# Altium schematic sheet 4_battery_monitoring_and_switches.schdoc: Batteries Monitor and Power Switches
size A3; DrawnBy: Sara V. Martínez; Engineer: Flight; DocumentNumber: 5; Revision: V0.1; SheetNumber: 5; SheetTotal: 11; Designed by: Andre M. P. Mattos; ProjectRevision: v0.2
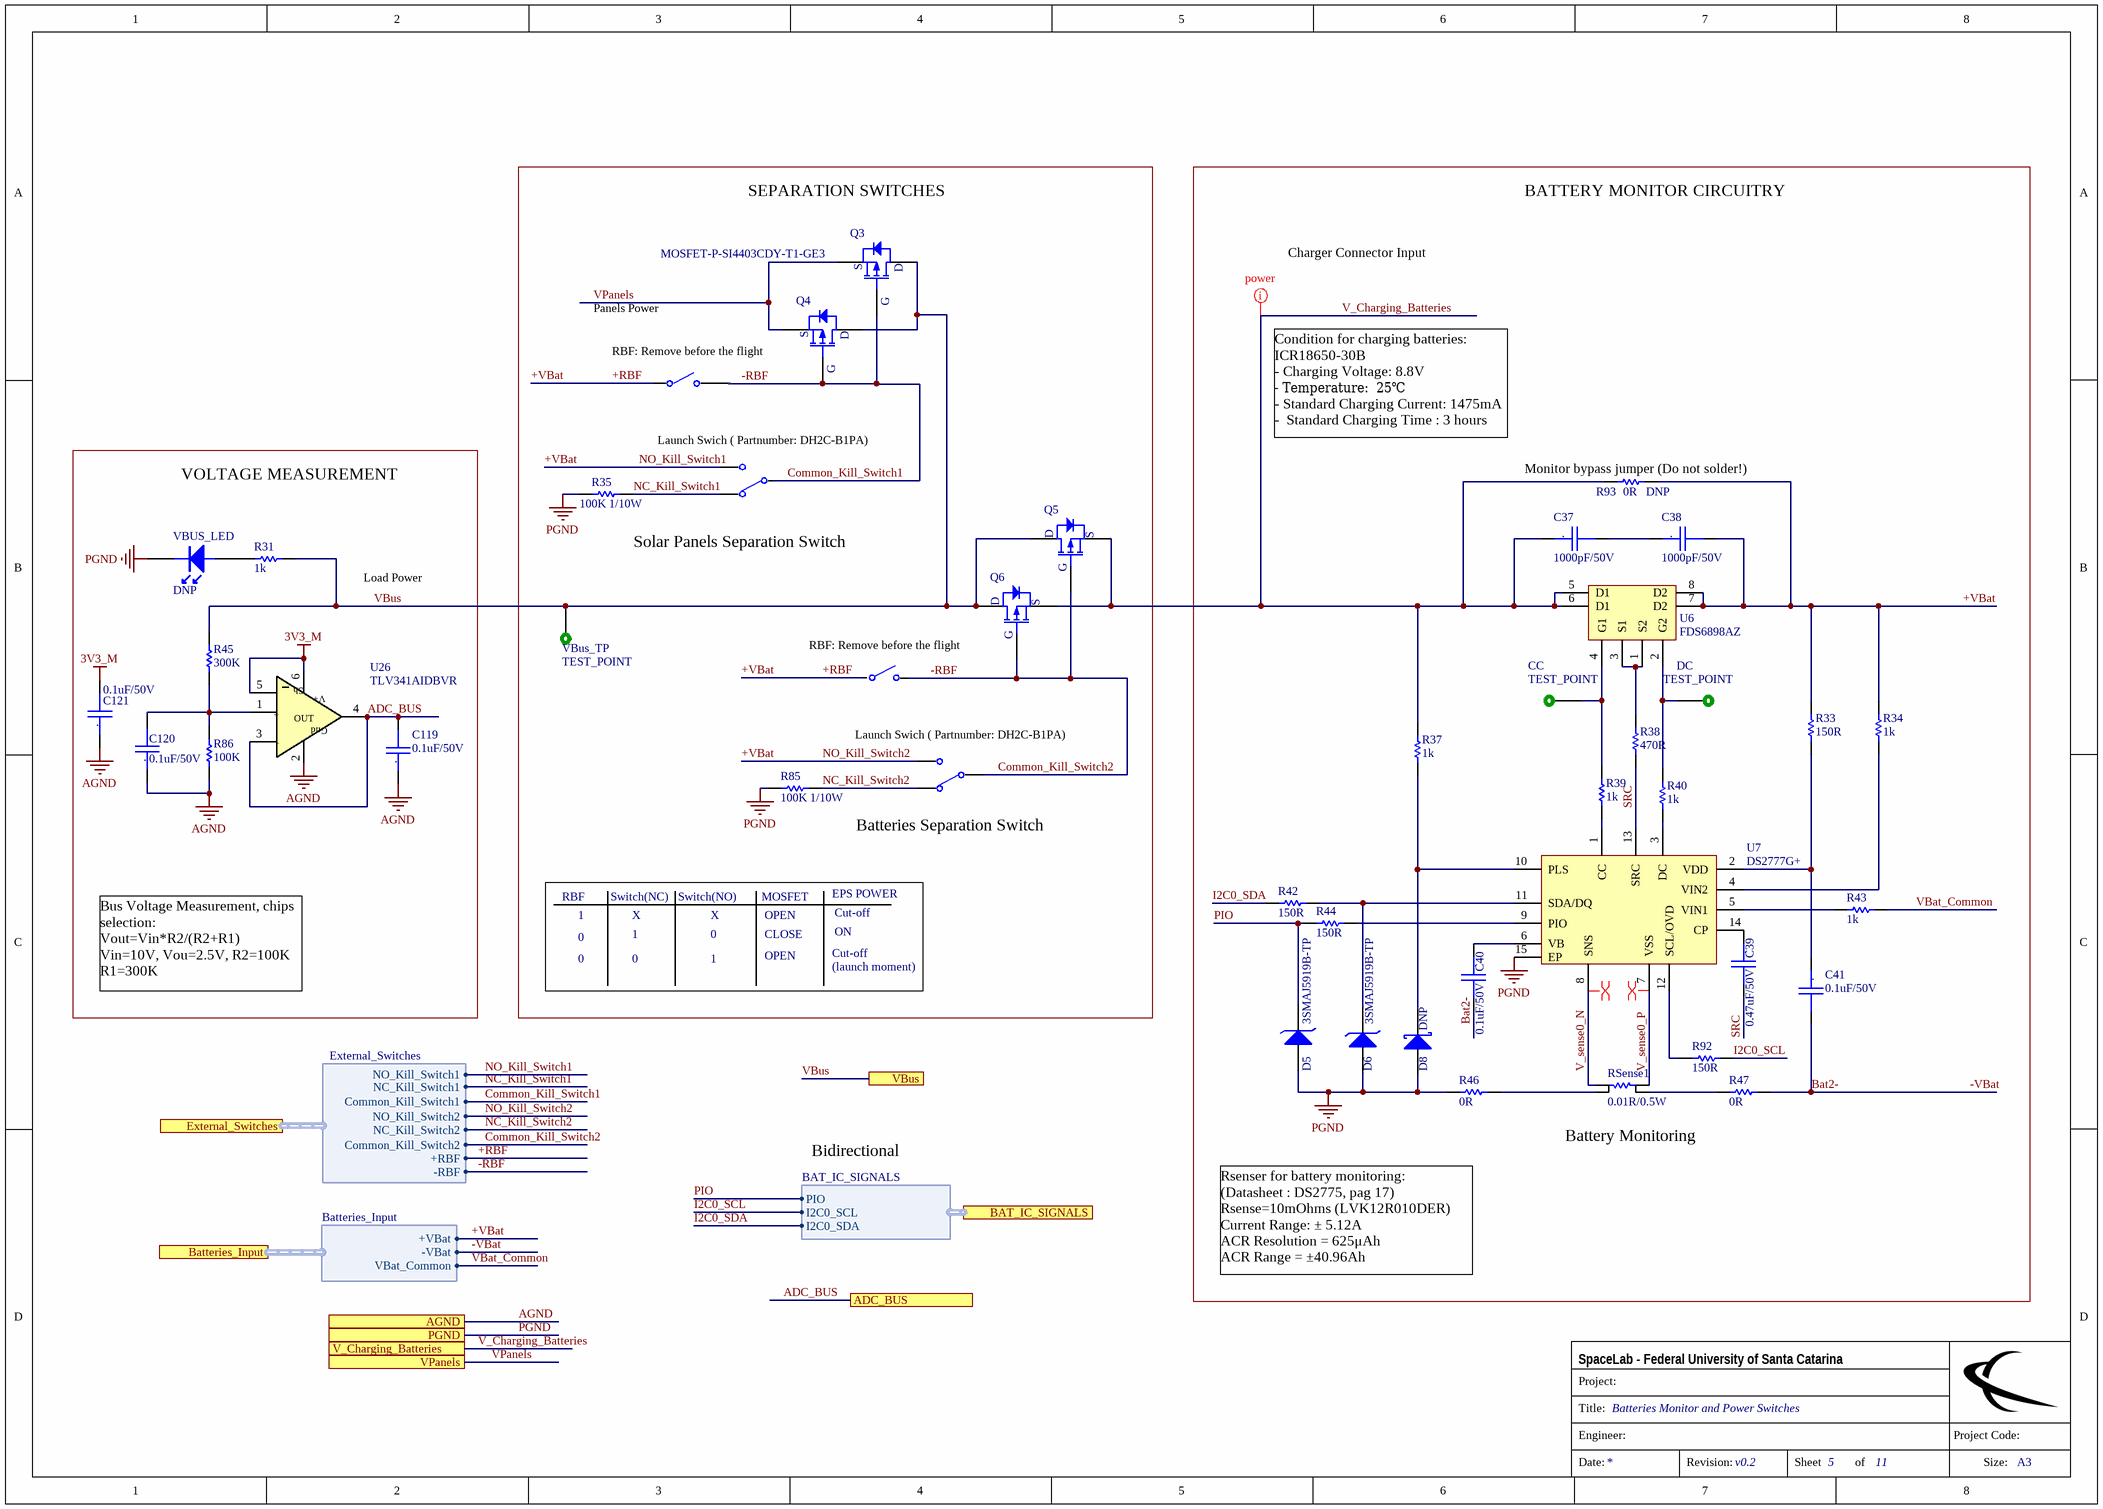
[diagram p0: 4_battery_monitoring_and_switches.schdoc]

## Parts
C37  1000pF/50V  [CC0603]
C38  1000pF/50V  [CC0603]
C39  0.47uF/50V  [CC0603]
C40  0.1uF/50V  [CC0603]
C41  0.1uF/50V  [CC0603]
C119  0.1uF/50V  [CC0603]
C120  0.1uF/50V  [CC0603]
C121  0.1uF/50V  [CC0603]
CC  TEST_POINT  [TEST_POINT]  (no BOM)
D5  3SMAJ5919B-TP  [DO-214AC]
D6  3SMAJ5919B-TP  [DO-214AC]
D8  DNP  [SOD323F]
DC  TEST_POINT  [TEST_POINT]  (no BOM)
Q3  MOSFET-P-SI4403CDY-T1-GE3  [SOIC8_Mosfet]  (value not drawn)
Q4  MOSFET-P-SI4403CDY-T1-GE3  [SOIC8_Mosfet]
Q5  MOSFET-P-SI4403CDY-T1-GE3  [SOIC8_Mosfet]  (value not drawn)
Q6  MOSFET-P-SI4403CDY-T1-GE3  [SOIC8_Mosfet]  (value not drawn)
R31  1k  [0603]
R33  150R  [0603]
R34  1k  [0603]
R35  100K 1/10W  [0805]
R37  1k  [0603]
R38  470R  [0603]
R39  1k  [0603]
R40  1k  [0603]
R42  150R  [0603]
R43  1k  [0603]
R44  150R  [0603]
R45  300K  [0603]
R46  0R  [1206]
R47  0R  [1206]
R85  100K 1/10W  [0805]
R86  100K  [0603]
R92  150R  [R0603]
R93  0R  [1206]
RSense1  0.01R/0.5W  [1206 - ohmite]
U6  FDS6898AZ  [SOIC8]
U7  DS2777G+  [TDFN-14-EP_3x5]
U26  TLV341AIDBVR  [SOT-23 6L]
VBUS_LED  DNP  [0603-LED]
VBus_TP  TEST_POINT  [TEST_POINT]  (no BOM)

## Blocks framed on the sheet
VOLTAGE MEASUREMENT: C119-C121 R31 R45 R86 U26 VBUS_LED

## Ports
ADC_BUS, AGND, BAT_IC_SIGNALS (harness BAT_IC_SIGNALS), Batteries_Input (harness Batteries_Input), External_Switches (harness External_Switches), PGND, V_Charging_Batteries, VBus, VPanels

## Harnesses
External_Switches: NO_Kill_Switch1, NC_Kill_Switch1, NO_Kill_Switch2, NC_Kill_Switch2, +RBF, -RBF, Common_Kill_Switch1, Common_Kill_Switch2
Batteries_Input: +VBat, -VBat, VBat_Common
BAT_IC_SIGNALS: I2C0_SCL, I2C0_SDA, PIO

## Nets
3V3_M: C121.2 U26.5(EN) U26.6(V+)
AGND: C119.1 C120.1 C121.1 R86.1 U26.2(Gnd) ; port AGND
PGND: D5.2(A) D6.2(A) D8.2(A) R35.2 R46.2 R85.2 U7.15(EP) VBUS_LED.2(K) ; port PGND
+RBF: C38.2 R33.1 R34.2 R93.1 U6.7(D2) U6.8(D2) ; port External_Switches.NO_Kill_Switch1, port External_Switches.NO_Kill_Switch2, port External_Switches.+RBF, port Batteries_Input.+VBat  [also labelled +VBat, NO_Kill_Switch1, NO_Kill_Switch2]
-RBF: Q3.2(G) Q4.2(G) Q5.2(G) Q6.2(G) ; port External_Switches.-RBF, port External_Switches.Common_Kill_Switch1, port External_Switches.Common_Kill_Switch2  [also labelled Common_Kill_Switch1, Common_Kill_Switch2]
-VBat: C40.2 C41.2 R47.1 ; port Batteries_Input.-VBat  [also labelled Bat2-]
ADC_BUS: C119.2 U26.3(-IN) U26.4(OUT) ; port ADC_BUS
I2C0_SCL: R92.1 ; port BAT_IC_SIGNALS.I2C0_SCL
I2C0_SDA: R42.2 ; port BAT_IC_SIGNALS.I2C0_SDA
NC_Kill_Switch1: R35.1 ; port External_Switches.NC_Kill_Switch1
NC_Kill_Switch2: R85.1 ; port External_Switches.NC_Kill_Switch2
PIO: D5.1(K) R44.2 ; port BAT_IC_SIGNALS.PIO
SRC: C39.2 R38.1 U7.13(SRC)
V_Charging_Batteries: C37.1 Q5.1(S) Q6.1(S) R37.2 R93.2 U6.5(D1) U6.6(D1) ; port V_Charging_Batteries
V_sense0_N: RSense1.2 U7.8(SNS)
V_sense0_P: RSense1.1 U7.7(VSS)
VBat_Common: R43.1 ; port Batteries_Input.VBat_Common
VBus: Q3.3(D) Q4.3(D) Q5.3(D) Q6.3(D) R31.1 R45.2 VBus_TP.1 ; port VBus
VPanels: Q3.1(S) Q4.1(S) ; port VPanels
NetC37_2: C37.2 C38.1
NetC39_1: C39.1 U7.14(CP)
NetC40_1: C40.1 U7.6(VB)
NetC41_1: C41.1 R33.2 U7.2(VDD)
NetC120_2: C120.2 R45.1 R86.2 U26.1(+IN)
NetCC_1: CC.1 R39.2 U6.4(G1)
NetD6_1: D6.1(K) R42.1 U7.11(SDA/DQ)
NetD8_1: D8.1(K) R37.1 U7.10(PLS)
NetDC_1: DC.1 R40.2 U6.2(G2)
NetR31_2: R31.2 VBUS_LED.1(A)
NetR34_1: R34.1 U7.4(VIN2)
NetR38_2: R38.2 U6.1(S2) U6.3(S1)
NetR39_1: R39.1 U7.1(CC)
NetR40_1: R40.1 U7.3(DC)
NetR43_2: R43.2 U7.5(VIN1)
NetR44_1: R44.1 U7.9(PIO)
NetR46_1: R46.1 RSense1.4
NetR47_2: R47.2 RSense1.3
NetR92_2: R92.2 U7.12(SCL/OVD)

## Layout directives
differential pair: V_sense0_N, V_sense0_P
net class power: V_Charging_Batteries

## Notes on the sheet
- SEPARATION SWITCHES
- BATTERY MONITOR CIRCUITRY
- Panels Power
- Charger Connector Input
- (near Q4) RBF: Remove before the flight
- Launch Swich ( Partnumber: DH2C-B1PA)
- Condition for charging batteries:  ICR18650-30B
  - Charging Voltage: 8.8V
  - Temperature:  25℃
  - Standard Charging Current: 1475mA
  -  Standard Charging Time : 3 hours
- (near R93) Monitor bypass jumper (Do not solder!)
- (near R93) DNP
- Load Power
- (near R35) Solar Panels Separation Switch
- (near Q6) RBF: Remove before the flight
- Batteries Separation Switch
- RBF
- 1
- Switch(NC)
- X
- Switch(NO)
- MOSFET
- OPEN
- EPS POWER
- Cut-off
- Bus Voltage Measurement, chips selection:
  Vout=Vin*R2/(R2+R1)
  Vin=10V, Vou=2.5V, R2=100K
  R1=300K
- 0
- CLOSE
- (launch moment)
- ON
- Bidirectional
- Battery Monitoring
- Rsenser for battery monitoring:
  (Datasheet : DS2775, pag 17)
  Rsense=10mOhms (LVK12R010DER)
  Current Range: ± 5.12A
  ACR Resolution = 625μAh
  ACR Range = ±40.96Ah
- Project:
- SpaceLab - Federal University of Santa Catarina
- Title:
- Engineer:
- Project Code:
- Date:
- Revision:
- Sheet
- of
- Size:
- A3
- (in symbol Cap_Cer_X7R_0.1uF_50V_0603) .
- (in symbol Cap_Cer_X7R_0.47uF_50V_0603) .
- (in symbol Cap_Cer_X7R_1000pF_50V_0603) .
- (in symbol TLV341AIDBVR) Sh; +; -

## Library data of the parts
C37 C38 = Cap_Cer_X7R_1000pF_50V_0603: CAP CER 1000pF 50V 10% X7R 0603; Partnumber: CC0603KRX7R9BB102; Manufacturer: Yageo; Capacitance: 1nF; Insulation Resistance: 100GR; Material: Ceramic; NCM: 8532.24.10; Case/Package: 0603; Case Code (Imperial): 0603; Case Code (Metric): 1608; ComponentLink1Description: http://www.yageo.com/documents/recent/UPY-GPHC_X7R_6.3V-to-50V_18.pdf?src-supplier=Digi-Key; ComponentLink1URL: http://www.yageo.com/documents/recent/UPY-GPHC_X7R_6.3V-to-50V_18.pdf?src-supplier=Digi-Key; ComponentLink2Description: http://www.yageo.com/documents/recent/UPY-GPHC_X7R_6.3V-to-50V_8.pdf?src-supplier=Avnet+Europe; ComponentLink2URL: http://www.yageo.com/documents/recent/UPY-GPHC_X7R_6.3V-to-50V_8.pdf?src-supplier=Avnet+Europe; ComponentLink3Description: https://www.verical.com/server-webapp/html/getDatasheet?partID=251790&src-supplier=Verical; ComponentLink3URL: https://www.verical.com/server-webapp/html/getDatasheet?partID=251790&src-supplier=Verical; ComponentLink4Description: http://www.farnell.com/datasheets/2167236.pdf?src-supplier=Element14; ComponentLink4URL: http://www.farnell.com/datasheets/2167236.pdf?src-supplier=Element14; ComponentLink5Description: https://produktinfo.conrad.com/datenblaetter/425000-449999/445532-da-01-en-KERKO_CHIP_0603_NP0_1000PF.pdf?src-supplier=Conrad; ComponentLink5URL: https://produktinfo.conrad.com/datenblaetter/425000-449999/445532-da-01-en-KERKO_CHIP_0603_NP0_1000PF.pdf?src-supplier=Conrad; Composition: Ceramic; Depth: 0.8mm; Dielectric: X7R; Halogen Free: Halogen Free; Height: 0.8mm; Lead Free: Lead Free; Length: 1.6mm; Manufacturer Part Number: CC0603KRX7R9BB102; Max Operating Temperature: 125°C; Min Operating Temperature: -55°C; Mount: Surface Mount; Number of Pins: 2; Package Quantity: 1; Packaging: Tape and Reel; Pricing 1: 1=0.1, 10=0.039, 100=0.018, 1000=0.014, 4000=0.01, 8000=0.008 (USD); Pricing 2: 1=0.1, 10=0.042, 50=0.0232, 100=0.0189, 500=0.01352, 1000=0.01062 (USD); Radiation Hardening: No; REACH SVHC: No SVHC; Stock 1: 411776; Stock 2: 2512329; Supplier 1: Mouser; Supplier 2: Digi-Key; Supplier Part Number 1: 603-CC603KRX7R9BB102; Supplier Part Number 2: 311-1080-1-ND; Termination: SMD/SMT; Thickness: 0.035inch; Tolerance: 10%; Voltage: 50V; Voltage Rating (DC): 50V; Voltage Rating: 50V; Width: 0.031inch
C39 = Cap_Cer_X7R_0.47uF_50V_0603: CAP CER 0.47UF 50V 10% X7R 0603; Partnumber: C1608X7R1H474K080AE; Manufacturer: TDK; Capacitance: 470nF; NCM: 8532.24.10; Case/Package: 0603; Case Code (Imperial): 0603; Case Code (Metric): 1608; ComponentLink1Description: http://www.mouser.com/ds/2/400/tdk_mlcc_commercial_general_en-542463.pdf?src-supplier=Mouser; ComponentLink1URL: http://www.mouser.com/ds/2/400/tdk_mlcc_commercial_general_en-542463.pdf?src-supplier=Mouser; ComponentLink2Description: https://product.tdk.com/info/en/catalog/datasheets/mlcc_commercial_soft_en.pdf?src-supplier=Digi-Key; ComponentLink2URL: https://product.tdk.com/info/en/catalog/datasheets/mlcc_commercial_soft_en.pdf?src-supplier=Digi-Key; ComponentLink3Description: https://product.tdk.com/info/en/catalog/spec/mlccspec_commercial_soft_en.pdf?src-supplier=Digi-Key; ComponentLink3URL: https://product.tdk.com/info/en/catalog/spec/mlccspec_commercial_soft_en.pdf?src-supplier=Digi-Key; Dielectric: X7R; Features: Soft Termination; Height: 0.8mm; Lead Free: Lead Free; Length: 0.063inch; Manufacturer Part Number: C1608X7R1H474K080AE; Max Operating Temperature: 125°C; Min Operating Temperature: -55°C; Mount: Surface Mount; Package Quantity: 4000; Packaging: Tape and Reel; Pricing 1: 1=0.35, 10=0.24, 100=0.144, 500=0.108, 1000=0.091, 4000=0.077 (USD); Pricing 2: 1=0.33, 10=0.23, 50=0.161, 100=0.1379, 500=0.10346, 1000=0.08736 (USD); Stock 1: 82530; Stock 2: 9176; Supplier 1: Mouser; Supplier 2: Digi-Key; Supplier Part Number 1: 810-C1608X7R1H474K0E; Supplier Part Number 2: 445-172485-1-ND; Termination: SMD/SMT; Thickness: 0.037inch; Tolerance: 10%; Voltage Rating (DC): 50V; Voltage Rating: 50V; Weight: 7.1E-05oz; Width: 0.8mm
C40 C41 C119-C121 = Cap_Cer_X7R_0.1uF_50V_0603: CAP CER 0.1UF 50V 10% X7R 0603; Partnumber: CC0603KPX7R9BB104; Manufacturer: Yageo; Capacitance: 100nF; Case/Package: 0603; Case Code (Imperial): 0603; Case Code (Metric): 1608; ComponentLink1Description: https://www.verical.com/server-webapp/html/getDatasheet?partID=653026&src-supplier=Verical; ComponentLink1URL: https://www.verical.com/server-webapp/html/getDatasheet?partID=653026&src-supplier=Verical; Composition: Ceramic; Depth: 0.8mm; Dielectric: X7R; Halogen Free: Halogen Free; Height: 0.8mm; Lead Free: Lead Free; Length: 1.6mm; Manufacturer Part Number: CC0603KPX7R9BB104; Max Operating Temperature: 125°C; Min Operating Temperature: -55°C; Mount: Surface Mount; Number of Pins: 2; Packaging: Tape and Reel; Pricing 1: 1=0.1, 10=0.065, 100=0.02, 1000=0.016, 2500=0.013, 10000=0.01 (USD); Pricing 2: 1=0.1, 10=0.066, 50=0.036, 100=0.0293, 500=0.02094, 1000=0.01646, 2500=0.01496, 5000=0.01376 (USD); Radiation Hardening: No; Stock 1: 5712768; Stock 2: 0; Supplier 1: Mouser; Supplier 2: Digi-Key; Supplier Part Number 1: 603-CC603KPX7R9BB104; Supplier Part Number 2: 311-3567-1-ND; Termination: SMD/SMT; Thickness: 0.035inch; Tolerance: 10%; Voltage Rating (DC): 50V; Voltage Rating: 50V; Weight: 7.1E-05oz; Width: 0.031inch
CC DC VBus_TP = TEST_POINT: Test point
D5 D6 = DIODE_ZENER_5.6V_3SMAJ5919B: DIODE ZENER 5.6V 3W DO214AC; Manufacturer: MCC; Element Configuration: Single; Impedance: 2R; Max Reverse Leakage Current: 5uA; Tolerance: 5%; Zener Current: 534mA; Partnumber: 3SMAJ5919B-TP; NCM: 8541.10.29; Case/Package: SMA; ComponentLink1Description: http://www.mccsemi.com/up_pdf/3SMAJ5913B~3SMAJ5943B(DO-214AC).pdf?src-supplier=Digi-Key; ComponentLink1URL: http://www.mccsemi.com/up_pdf/3SMAJ5913B~3SMAJ5943B(DO-214AC).pdf?src-supplier=Digi-Key; Manufacturer Part Number: 3SMAJ5919B-TP; Max Operating Temperature: 150°C; Max Power Dissipation: 3W; Min Operating Temperature: -55°C; Mount: Surface Mount; Number of Pins: 2; Package Quantity: 7500; Packaging: Tape and Reel; Power Dissipation: 3W; Pricing 1: 1=0.48, 10=0.354, 100=0.225, 500=0.199, 1000=0.143, 2500=0.134 (USD); Pricing 2: 1=0.46, 10=0.376, 25=0.344, 100=0.216, 250=0.2136, 500=0.2, 1000=0.136, 2500=0.1304 (USD); Stock 1: 26433; Stock 2: 61482; Supplier 1: Mouser; Supplier 2: Digi-Key; Supplier Part Number 1: 833-3SMAJ5919B-TP; Supplier Part Number 2: 3SMAJ5919B-TPMSCT-ND; Voltage Tolerance: 5%; Zener Voltage: 5.6V
D8 = DIODE_SCHOTTKY_23V_1A_NSVR0320MW2T1G: DIODE SCHOTTKY 23V 1A SOD323F; Manufacturer: ON Semiconductor; Element Configuration: Single; Forward Voltage: 500mV; Max Forward Surge Current (Ifsm): 5A; Max Repetitive Reverse Voltage (Vrrm): 20V; Max Reverse Leakage Current: 1mA; Peak Reverse Current: 50uA; NCM: 8541.10.29; Partnumber: NSVR0320MW2T1G; Average Rectified Current: 1A; Case/Package: SOD-323-2; ComponentLink1Description: http://www.onsemi.com/pub/Collateral/NSR0320MW2T1-D.PDF?src-supplier=Avnet; ComponentLink1URL: http://www.onsemi.com/pub/Collateral/NSR0320MW2T1-D.PDF?src-supplier=Avnet; ComponentLink2Description: http://www.onsemi.com/pub/Collateral/NSR0320MW2T1-D.PDF?src-supplier=Digi-Key; ComponentLink2URL: http://www.onsemi.com/pub/Collateral/NSR0320MW2T1-D.PDF?src-supplier=Digi-Key; Forward Current: 1A; Height: 0.9mm; Lead Free: Lead Free; Length: 1.8mm; Manufacturer Part Number: NSVR0320MW2T1G; Max Operating Temperature: 125°C; Max Reverse Voltage (DC): 20V; Max Surge Current: 5A; Min Operating Temperature: -55°C; Number of Pins: 2; Package Quantity: 3000; Packaging: Tape and Reel; Pricing 1: 1=0.38, 10=0.254, 100=0.118, 1000=0.092, 3000=0.081, 9000=0.071 (USD); Pricing 2: 1=0.38, 10=0.282, 25=0.2548, 100=0.1343, 250=0.13288, 500=0.119, 1000=0.0926 (USD); Radiation Hardening: No; REACH SVHC: No SVHC; Stock 1: 10408; Stock 2: 4746; Supplier 1: Mouser; Supplier 2: Digi-Key; Supplier Part Number 1: 863-NSVR0320MW2T1G; Supplier Part Number 2: NSVR0320MW2T1GOSCT-ND; Width: 1.35mm
Q3-Q6 = MOSFET-P- SI4403CDY-T1-GE3: MOSFET 1.8V P-Channel 20 V, 0.0155 Ω typ., 13.4 A; Manufacturer: Vishay Siliconix; Continuous Drain Current (ID): 13.4A; Drain to Source Breakdown Voltage: 20V; Drain to Source Resistance: 15.5mR; Fall Time: 41ns; Gate to Source Voltage (Vgs): 8V; Input Capacitance: 2.38nF; Max Power Dissipation: 5W; Number of Channels: 1; Power Dissipation: 2.5W; Rise Time: 18ns; Threshold Voltage: -400mV; Turn-Off Delay Time: 108ns; Turn-On Delay Time: 7ns; Published: 8-Jun-2000; LatestRevisionDate: 17-Jul-2002; LatestRevisionNote: Re-released for DXP Platform.; PackageVersion: 1995/1996; PackageReference: E3; Publisher: Altium Limited; PackageDescription: TO, Flat Index; 3 In-Line, Axial Leads; Body Dia. 4.6mm; Lead Dia. 0.5 mm (max); Partnumber: SI4403CDY-T1-GE3; Case/Package: SOIC; ComponentLink1Description: http://www.vishay.com/docs/71385/lokreel.pdf?src-supplier=Digi-Key; ComponentLink1URL: http://www.vishay.com/docs/71385/lokreel.pdf?src-supplier=Digi-Key; ComponentLink2Description: http://www.vishay.com/docs/67341/si4403cd.pdf?src-supplier=Avnet; ComponentLink2URL: http://www.vishay.com/docs/67341/si4403cd.pdf?src-supplier=Avnet; ComponentLink3Description: http://www.vishay.com/docs/67341/si4403cd.pdf?src-supplier=Avnet+Europe; ComponentLink3URL: http://www.vishay.com/docs/67341/si4403cd.pdf?src-supplier=Avnet+Europe; ComponentLink4Description: http://www.farnell.com/datasheets/1915828.pdf?src-supplier=Element14; ComponentLink4URL: http://www.farnell.com/datasheets/1915828.pdf?src-supplier=Element14; Contact Plating: Tin,Matte; Drain to Source Voltage (Vdss): 20V; Lead Free: Lead Free; Manufacturer Part Number: SI4403CDY-T1-GE3; Max Operating Temperature: 150°C; Min Operating Temperature: -55°C; Mount: Surface Mount; Number of Elements: 1; Number of Pins: 8; On-State Resistance: 15.5mR; Package Quantity: 2500; Packaging: Tape and Reel; Pricing 1: 1=0.68, 10=0.606, 100=0.472, 500=0.388, 1000=0.327, 2500=0.289 (USD); Pricing 2: 1=0.75, 10=0.66, 25=0.62, 100=0.45, 250=0.434, 500=0.376, 1000=0.32 (USD); Radiation Hardening: No; Rds On Max: 15.5mR; REACH SVHC: No SVHC; Stock 1: 6738; Stock 2: 1673; Supplier 1: Mouser; Supplier 2: Digi-Key; Supplier Part Number 1: 78-SI4403CDY-T1-GE3; Supplier Part Number 2: SI4403CDY-T1-GE3CT-ND; Weight: 0.01787oz
R31 R34 R37 R39 R40 R43 = R1.0k_1%_1/8W_0603: RES 1.0K OHM 1/8W 1% 0603; Partnumber: MCT06030C1001FP500; Manufacturer: Vishay; Max Power Dissipation: 125mW; Power Rating: 100mW; Resistance: 1kR; Temperature Coefficient: 50ppm/°C; Voltage Rating (DC): 75V; NCM: 8533.21.20; Case/Package: 0603; Case Code (Imperial): 0603; Case Code (Metric): 1608; ComponentLink1Description: http://www.vishay.com/docs/28705/mcx0x0xpro.pdf?src-supplier=Digi-Key; ComponentLink1URL: http://www.vishay.com/docs/28705/mcx0x0xpro.pdf?src-supplier=Digi-Key; ComponentLink2Description: http://www.vishay.com/docs/28705/mc_pro.pdf?src-supplier=Avnet+Europe; ComponentLink2URL: http://www.vishay.com/docs/28705/mc_pro.pdf?src-supplier=Avnet+Europe; ComponentLink3Description: http://www.vishay.com/docs/28705/mc_pro.pdf?src-supplier=Avnet; ComponentLink3URL: http://www.vishay.com/docs/28705/mc_pro.pdf?src-supplier=Avnet; ComponentLink4Description: http://www.vishay.com/docs/28705/mc_pro.pdf?src-supplier=Future+Electronics; ComponentLink4URL: http://www.vishay.com/docs/28705/mc_pro.pdf?src-supplier=Future+Electronics; Composition: Thin Film; Contact Plating: Tin; Depth: 0.85mm; Height: 0.022inch; Lead Free: Lead Free; Length: 1.55mm; Manufacturer Part Number: MCT06030C1001FP500; Max Operating Temperature: 125°C; Military Standard: Not; Min Operating Temperature: -55°C; Mount: Surface Mount; Number of Terminations: 2; Package Quantity: 1; Packaging: Tape and Reel; Pricing 1: 1=0.1, 1000=0.025, 2000=0.023, 5000=0.019, 10000=0.018, 20000=0.017 (USD); Pricing 2: 1=0.17, 10=0.145, 100=0.0568, 1000=0.02376, 2500=0.02178 (USD); Radiation Hardening: No; REACH SVHC: Unknown; Stock 1: 142157; Stock 2: 268907; Supplier 1: Mouser; Supplier 2: Digi-Key; Supplier Part Number 1: 594-MCT06030C1001FP5; Supplier Part Number 2: MCT0603-1.00K-CFCT-ND; Termination: SMD/SMT; Tolerance: 1%; Voltage Rating: 75V; Weight: 7.1E-05oz; Width: 0.033inch
R33 R42 R44 = R150R_1%_1/10W_0603: RES 150R OHM 1/10W 1% 0603; Partnumber: CRCW0603150RFKEA; Manufacturer: Vishay; Max Power Dissipation: 100mW; Temperature Coefficient: 100ppm/°C; Voltage Rating (DC): 75V; NCM: 8533.21.20; Case/Package: 0603; Case Code (Imperial): 0603; Case Code (Metric): 1608; ComponentLink1Description: http://www.vishay.com/docs/20035/dcrcwe3.pdf?src-supplier=Digi-Key; ComponentLink1URL: http://www.vishay.com/docs/20035/dcrcwe3.pdf?src-supplier=Digi-Key; ComponentLink2Description: http://www.mouser.com/ds/2/427/dcrcwe3-109170.pdf?src-supplier=Mouser; ComponentLink2URL: http://www.mouser.com/ds/2/427/dcrcwe3-109170.pdf?src-supplier=Mouser; ComponentLink3Description: http://uk.rs-online.com/webdocs/0d98/0900766b80d98afc.pdf?src-supplier=RSComponents; ComponentLink3URL: http://uk.rs-online.com/webdocs/0d98/0900766b80d98afc.pdf?src-supplier=RSComponents; ComponentLink4Description: http://www.vishay.com/docs/20035/dcrcwe3.pdf?src-supplier=Avnet+Europe; ComponentLink4URL: http://www.vishay.com/docs/20035/dcrcwe3.pdf?src-supplier=Avnet+Europe; ComponentLink5Description: https://www.distrelec.biz/Web/Downloads/a_/en/flD-CRCW-e3_data_en.pdf?mime=application%2Fpdf&src-supplier=Distrelec; ComponentLink5URL: https://www.distrelec.biz/Web/Downloads/a_/en/flD-CRCW-e3_data_en.pdf?mime=application%2Fpdf&src-supplier=Distrelec; ComponentLink6Description: http://www.farnell.com/datasheets/2310790.pdf?src-supplier=Element14; ComponentLink6URL: http://www.farnell.com/datasheets/2310790.pdf?src-supplier=Element14; ComponentLink7Description: https://www.alliedelec.com/m/d/0c934d6939ccefa68dbe0b96d821c8cf.pdf?src-supplier=Allied+Electronics; ComponentLink7URL: https://www.alliedelec.com/m/d/0c934d6939ccefa68dbe0b96d821c8cf.pdf?src-supplier=Allied+Electronics; ComponentLink8Description: http://www.vishay.com/docs/20035/dcrcwe3.pdf?src-supplier=Avnet; ComponentLink8URL: http://www.vishay.com/docs/20035/dcrcwe3.pdf?src-supplier=Avnet; Composition: Thick Film; Contact Plating: Tin; Depth: 0.85mm; Features: Automotive AEC-Q200; Height: 0.45mm; Lead Free: Lead Free; Length: 1.55mm; Manufacturer Part Number: CRCW0603150RFKEA; Max Operating Temperature: 155°C; Military Standard: Not; Min Operating Temperature: -55°C; Mount: Surface Mount; Number of Terminations: 2; Package Quantity: 10; Packaging: Tape and Reel; Power Rating: 100mW; Pricing 1: 1=0.1, 10=0.037, 100=0.034, 500=0.015, 1000=0.006, 2500=0.005 (USD); Pricing 2: 1=0.1, 10=0.034, 100=0.0139, 1000=0.00623, 2500=0.0054 (USD); Radiation Hardening: No; REACH SVHC: Unknown; Resistance: 150R; Stock 1: 109151; Stock 2: 5196; Supplier 1: Mouser; Supplier 2: Digi-Key; Supplier Part Number 1: 71-CRCW0603-150-E3; Supplier Part Number 2: 541-150HCT-ND; Termination: SMD/SMT; Tolerance: 1%; Voltage Rating: 75V; Weight: 7.1E-05oz; Width: 0.033inch
R35 R85 = R100k_0.1%_1/10W_0805: RES 100K OHM 1/10W 0.1% 0805; Partnumber: CPF-A-0805B100KE; Manufacturer: TE Connectivity; Max Power Dissipation: 100mW; Resistance: 100kR; Temperature Coefficient: 25ppm/°C; NCM: 8533.21.20; Case/Package: 0805; Case Code (Imperial): 0805; Case Code (Metric): 2012; ComponentLink1Description: https://www.te.com/commerce/DocumentDelivery/DDEController?Action=srchrtrv&amp;DocNm=1773200-1&amp;DocType=DS&amp;DocLang=English&src-supplier=Digi-Key; ComponentLink1URL: https://www.te.com/commerce/DocumentDelivery/DDEController?Action=srchrtrv&amp;DocNm=1773200-1&amp;DocType=DS&amp;DocLang=English&src-supplier=Digi-Key; Composition: Thin Film; Features: Moisture Resistant,Automotive AEC-Q200,Anti-Sulfur; Manufacturer Part Number: CPF-A-0805B100KE; Max Operating Temperature: 155°C; Min Operating Temperature: -55°C; Number of Terminations: 2; Packaging: Tape and Reel; Pricing 1: 1=0.57, 10=0.405, 100=0.2107, 1000=0.11343, 2500=0.11019 (USD); Stock 1: 2170; Supplier 1: Digi-Key; Supplier Part Number 1: 1712-CPF-A-0805B100KECT-ND; Tolerance: 0.1%
R38 = R470R_1%_1/8W_0603: RES 470R OHM 1/8W 1% 0603; Partnumber: MCT06030C4700FP500; Manufacturer: Vishay Beyschlag; Max Power Dissipation: 125mW; Temperature Coefficient: 50ppm/°C; Voltage Rating (DC): 75V; NCM: 8533.21.20; Case/Package: 0603; Case Code (Imperial): 0603; Case Code (Metric): 1608; ComponentLink1Description: http://www.vishay.com/docs/28705/mcx0x0xpro.pdf?src-supplier=Digi-Key; ComponentLink1URL: http://www.vishay.com/docs/28705/mcx0x0xpro.pdf?src-supplier=Digi-Key; ComponentLink2Description: http://www.vishay.com/docs/28705/mc_pro.pdf?src-supplier=Avnet; ComponentLink2URL: http://www.vishay.com/docs/28705/mc_pro.pdf?src-supplier=Avnet; ComponentLink3Description: http://www.vishay.com/docs/28705/mc_pro.pdf?src-supplier=Future+Electronics; ComponentLink3URL: http://www.vishay.com/docs/28705/mc_pro.pdf?src-supplier=Future+Electronics; ComponentLink4Description: http://www.vishay.com/docs/28705/mc_pro.pdf?src-supplier=Avnet+Europe; ComponentLink4URL: http://www.vishay.com/docs/28705/mc_pro.pdf?src-supplier=Avnet+Europe; Composition: Thin Film; Contact Plating: Tin; Depth: 0.85mm; Height: 0.022inch; Lead Free: Lead Free; Length: 0.061inch; Manufacturer Part Number: MCT06030C4700FP500; Max Operating Temperature: 125°C; Military Standard: Not; Min Operating Temperature: -55°C; Number of Terminations: 2; Package Quantity: 1; Packaging: Tape and Reel; Power Rating: 125mW; Pricing 1: 1=0.16, 50=0.076, 100=0.06, 500=0.034, 1000=0.023, 5000=0.019 (USD); Pricing 2: 1=0.17, 10=0.145, 100=0.0568, 1000=0.02376, 2500=0.02178 (USD); Radiation Hardening: No; REACH SVHC: No SVHC; Resistance: 470R; Stock 1: 14813; Stock 2: 21456; Supplier 1: Mouser; Supplier 2: Digi-Key; Supplier Part Number 1: 594-MCT06030C4700FP5; Supplier Part Number 2: MCT0603-470-CFCT-ND; Tolerance: 1%; Voltage Rating: 75V; Width: 0.033inch
R45 = R300K_0.1%_1/10W_0603: RES 300K OHM 1/10W 0.1% 0603; Partnumber: RG1608P-304-B-T5; Manufacturer: Susumu; Max Power Dissipation: 100mW; Power Rating: 62.5mW; Resistance: 300kR; Temperature Coefficient: 25ppm/°C; Voltage Rating (DC): 75V; NCM: 8533.21.20; Case/Package: 0603; Case Code (Imperial): 0603; Case Code (Metric): 1608; ComponentLink1Description: http://susumu-usa.com/pdf/RG_RM_RGH_DATASHEET.pdf?src-supplier=Future+Electronics; ComponentLink1URL: http://susumu-usa.com/pdf/RG_RM_RGH_DATASHEET.pdf?src-supplier=Future+Electronics; ComponentLink2Description: http://www.mouser.com/ds/2/392/n_catalog_partition01_en-1140338.pdf?src-supplier=Mouser; ComponentLink2URL: http://www.mouser.com/ds/2/392/n_catalog_partition01_en-1140338.pdf?src-supplier=Mouser; Composition: Thin Film; Height: 0.02inch; Lead Free: Lead Free; Length: 0.063inch; Manufacturer Part Number: RG1608P-304-B-T5; Max Operating Temperature: 155°C; Min Operating Temperature: -55°C; Number of Terminations: 2; Package Quantity: 1; Packaging: Tape and Reel; Pricing 1: 1=0.4, 10=0.303, 100=0.127, 500=0.102, 1000=0.07, 2500=0.065 (USD); Pricing 2: 1=0.4, 10=0.303, 100=0.1273, 1000=0.07022, 2500=0.06584 (USD); Stock 1: 6874; Stock 2: 54195; Supplier 1: Mouser; Supplier 2: Digi-Key; Supplier Part Number 1: 754-RG1608P-304-B-T5; Supplier Part Number 2: RG16P300KBCT-ND; Termination: SMD/SMT; Tolerance: 0.1%; Voltage Rating: 75V; Width: 0.031inch
R46 R47 R93 = R0R_JUMPER_3/4W_1206: RES 0.0 OHM 3/4W JUMP 1206; Partnumber: HCJ1206ZT0R00; Manufacturer: Stackpole Electronics; Resistance: 0mR; Fitted: No (jumper resistor); Case/Package: 1206; Case Code (Imperial): 1206; Case Code (Metric): 3216; ComponentLink1Description: http://www.seielect.com/Catalog/SEI-HCJ.pdf?src-supplier=Avnet; ComponentLink1URL: http://www.seielect.com/Catalog/SEI-HCJ.pdf?src-supplier=Avnet; ComponentLink2Description: https://www.seielect.com/Catalog/SEI-HCJ.pdf?src-supplier=Avnet+Asia; ComponentLink2URL: https://www.seielect.com/Catalog/SEI-HCJ.pdf?src-supplier=Avnet+Asia; ComponentLink3Description: https://www.seielect.com/catalog/SEI-HCJ.pdf?src-supplier=Digi-Key; ComponentLink3URL: https://www.seielect.com/catalog/SEI-HCJ.pdf?src-supplier=Digi-Key; ComponentLink4Description: https://www.seielect.com/catalog/SEI-Packaging.pdf?src-supplier=Digi-Key; ComponentLink4URL: https://www.seielect.com/catalog/SEI-Packaging.pdf?src-supplier=Digi-Key; Features: Automotive AEC-Q200; Height: 0.026inch; Length: 0.122inch; Manufacturer Part Number: HCJ1206ZT0R00; Max Operating Temperature: 155°C; Min Operating Temperature: -55°C; Mount: Surface Mount; Number of Terminations: 2; Package Quantity: 5000; Packaging: Tape and Reel; Pricing 1: 1=0.5, 10=0.358, 25=0.2788, 50=0.236, 100=0.1859, 250=0.15732, 500=0.1287, 1000=0.1001 (USD); Radiation Hardening: No; Stock 1: 1958428; Supplier 1: Digi-Key; Supplier Part Number 1: HCJ1206ZT0R00CT-ND; Termination: Wraparound; Width: 0.061inch
R86 = R100K_1%_1/10W_0603: RES 100K OHM 1/10W 1% 0603; Partnumber: CRCW0603100KFKEA; Manufacturer: Vishay; Manufacturer Part Number: CRCW0603-100KFKEA; Max Power Dissipation: 100mW; Resistance: 100kR; Temperature Coefficient: 100ppm/°C; Voltage Rating (DC): 75V; NCM: 8533.21.20; Case/Package: 0603; Case Code (Imperial): 0603; Case Code (Metric): 1608; ComponentLink1Description: http://www.vishay.com/docs/20035/dcrcwe3.pdf?src-supplier=Digi-Key; ComponentLink1URL: http://www.vishay.com/docs/20035/dcrcwe3.pdf?src-supplier=Digi-Key; ComponentLink2Description: http://www.farnell.com/datasheets/2310790.pdf?src-supplier=Element14; ComponentLink2URL: http://www.farnell.com/datasheets/2310790.pdf?src-supplier=Element14; ComponentLink3Description: https://www.verical.com/server-webapp/html/getDatasheet?partID=93113&src-supplier=Verical; ComponentLink3URL: https://www.verical.com/server-webapp/html/getDatasheet?partID=93113&src-supplier=Verical; ComponentLink4Description: http://www.farnell.com/datasheets/2045673.pdf?src-supplier=Element14; ComponentLink4URL: http://www.farnell.com/datasheets/2045673.pdf?src-supplier=Element14; ComponentLink5Description: http://www.farnell.com/datasheets/2310790.pdf?src-supplier=Avnet; ComponentLink5URL: http://www.farnell.com/datasheets/2310790.pdf?src-supplier=Avnet; ComponentLink6Description: http://www.farnell.com/datasheets/2310790.pdf?src-supplier=Allied+Electronics; ComponentLink6URL: http://www.farnell.com/datasheets/2310790.pdf?src-supplier=Allied+Electronics; ComponentLink7Description: http://www.vishay.com/docs/20035/dcrcwe3.pdf?src-supplier=Avnet; ComponentLink7URL: http://www.vishay.com/docs/20035/dcrcwe3.pdf?src-supplier=Avnet; ComponentLink8Description: http://www.farnell.com/datasheets/2310790.pdf?src-supplier=Mouser; ComponentLink8URL: http://www.farnell.com/datasheets/2310790.pdf?src-supplier=Mouser; ComponentLink9Description: http://uk.rs-online.com/webdocs/0d98/0900766b80d98afc.pdf?src-supplier=RSComponents; ComponentLink9URL: http://uk.rs-online.com/webdocs/0d98/0900766b80d98afc.pdf?src-supplier=RSComponents; ComponentLink10Description: http://www.farnell.com/datasheets/2310790.pdf?src-supplier=Distrelec; ComponentLink10URL: http://www.farnell.com/datasheets/2310790.pdf?src-supplier=Distrelec; ComponentLink11Description: http://www.vishay.com/docs/20008/dcrcw.pdf?src-supplier=Avnet+Europe; ComponentLink11URL: http://www.vishay.com/docs/20008/dcrcw.pdf?src-supplier=Avnet+Europe; Composition: Thick Film; Contact Plating: Tin,Lead; Depth: 0.85mm; Features: Automotive AEC-Q200; Height: 0.45mm; Lead Free: Lead Free; Length: 1.55mm; Max Operating Temperature: 155°C; Military Standard: Not; Min Operating Temperature: -55°C; Number of Pins: 2; Number of Terminations: 2; Package Quantity: 10; Packaging: Tape and Reel; Power Rating: 100mW; Pricing 1: 1=0.1, 10=0.037, 100=0.015, 500=0.006, 1000=0.004, 5000=0.004 (USD); Pricing 2: 1=0.1, 10=0.034, 100=0.0139, 1000=0.00623, 2500=0.0054 (USD); Radiation Hardening: No; REACH SVHC: Unknown; Stock 1: 53; Stock 2: 34451; Supplier 1: Mouser; Supplier 2: Digi-Key; Supplier Part Number 1: 71-CRCW0603-100K-E3; Supplier Part Number 2: 541-100KHCT-ND; Termination: SMD/SMT; Tolerance: 1%; Voltage Rating: 75V; Weight: 7.1E-05oz; Width: 0.033inch
R92 = R150R_1%_1/10W_0603: RES 150R OHM 1/10W 1% 0603; Partnumber: CRCW0603150RFKEA; Manufacturer: Vishay; Temperature Coefficient: 100ppm/°C; Power Rating: 100mW; Voltage Rating: 75V; NCM: 8533.21.20; Supplier 1: Mouser; Supplier Part Number 1: 71-CRCW0603-150-E3; Stock 1: 109151; Pricing 1: 1=0.1, 10=0.037, 100=0.034, 500=0.015, 1000=0.006, 2500=0.005 (USD); Mount: Surface Mount; Case/Package: 0603; Weight: 7.1E-05oz; Contact Plating: Tin; Case Code (Metric): 1608; Case Code (Imperial): 0603; Min Operating Temperature: -55°C; Max Operating Temperature: 155°C; Tolerance: 1%; Resistance: 150R; Composition: Thick Film; Termination: SMD/SMT; Packaging: Tape and Reel; Package Quantity: 10; Number of Terminations: 2; Military Standard: Not; Max Power Dissipation: 100mW; Voltage Rating (DC): 75V; Features: Automotive AEC-Q200; Length: 1.55mm; Height: 0.45mm; Width: 0.033inch; Depth: 0.85mm; Radiation Hardening: No; Lead Free: Lead Free; REACH SVHC: Unknown; ComponentLink1URL: http://www.vishay.com/docs/20035/dcrcwe3.pdf?src-supplier=Digi-Key; ComponentLink1Description: http://www.vishay.com/docs/20035/dcrcwe3.pdf?src-supplier=Digi-Key; ComponentLink2URL: http://www.mouser.com/ds/2/427/dcrcwe3-109170.pdf?src-supplier=Mouser; ComponentLink2Description: http://www.mouser.com/ds/2/427/dcrcwe3-109170.pdf?src-supplier=Mouser; ComponentLink3URL: http://uk.rs-online.com/webdocs/0d98/0900766b80d98afc.pdf?src-supplier=RSComponents; ComponentLink3Description: http://uk.rs-online.com/webdocs/0d98/0900766b80d98afc.pdf?src-supplier=RSComponents; ComponentLink4URL: http://www.vishay.com/docs/20035/dcrcwe3.pdf?src-supplier=Avnet+Europe; ComponentLink4Description: http://www.vishay.com/docs/20035/dcrcwe3.pdf?src-supplier=Avnet+Europe; ComponentLink5URL: https://www.distrelec.biz/Web/Downloads/a_/en/flD-CRCW-e3_data_en.pdf?mime=application%2Fpdf&src-supplier=Distrelec; ComponentLink5Description: https://www.distrelec.biz/Web/Downloads/a_/en/flD-CRCW-e3_data_en.pdf?mime=application%2Fpdf&src-supplier=Distrelec; ComponentLink6URL: http://www.farnell.com/datasheets/2310790.pdf?src-supplier=Element14; ComponentLink6Description: http://www.farnell.com/datasheets/2310790.pdf?src-supplier=Element14; ComponentLink7URL: https://www.alliedelec.com/m/d/0c934d6939ccefa68dbe0b96d821c8cf.pdf?src-supplier=Allied+Electronics; ComponentLink7Description: https://www.alliedelec.com/m/d/0c934d6939ccefa68dbe0b96d821c8cf.pdf?src-supplier=Allied+Electronics; ComponentLink8URL: http://www.vishay.com/docs/20035/dcrcwe3.pdf?src-supplier=Avnet; ComponentLink8Description: http://www.vishay.com/docs/20035/dcrcwe3.pdf?src-supplier=Avnet; Supplier 2: Digi-Key; Supplier Part Number 2: 541-150HCT-ND; Stock 2: 5196; Pricing 2: 1=0.1, 10=0.034, 100=0.0139, 1000=0.00623, 2500=0.0054 (USD); Manufacturer Part Number: CRCW0603150RFKEA
RSense1 = R0.01R_0.5%_0.5W_1206_4_terminal: Current Sense Resistors - SMD 0.01ohm .5% 4 Terminal; Partnumber: LVK12R010DER; Manufacturer: Ohmite; Max Power Dissipation: 500mW; Resistance: 10mR; Temperature Coefficient: 50ppm/°C; Tolerance: 0.5%; NCM: 8533.21.20; Case/Package: 1206; Case Code (Imperial): 1206; Case Code (Metric): 3216; ComponentLink1Description: http://www.mouser.com/ds/2/303/res_lvk-526397.pdf?src-supplier=Mouser; ComponentLink1URL: http://www.mouser.com/ds/2/303/res_lvk-526397.pdf?src-supplier=Mouser; ComponentLink2Description: http://www.ohmite.com/assets/docs/res_lvk.pdf?r=false&src-supplier=Digi-Key; ComponentLink2URL: http://www.ohmite.com/assets/docs/res_lvk.pdf?r=false&src-supplier=Digi-Key; ComponentLink3Description: http://www.farnell.com/datasheets/2553343.pdf?src-supplier=Element14; ComponentLink3URL: http://www.farnell.com/datasheets/2553343.pdf?src-supplier=Element14; ComponentLink4Description: http://www.farnell.com/datasheets/1928848.pdf?src-supplier=Element14; ComponentLink4URL: http://www.farnell.com/datasheets/1928848.pdf?src-supplier=Element14; ComponentLink5Description: https://www.alliedelec.com/m/d/8bcba2f42146915c5c22f667886779d2.pdf?src-supplier=Allied+Electronics; ComponentLink5URL: https://www.alliedelec.com/m/d/8bcba2f42146915c5c22f667886779d2.pdf?src-supplier=Allied+Electronics; Composition: Thick Film,Metal Film,Thin Film; Depth: 1.6mm; Features: Moisture Resistant; Height: 0.5mm; Length: 3.2mm; Manufacturer Part Number: LVK12R010DER; Max Operating Temperature: 125°C; Min Operating Temperature: -40°C; Mount: Surface Mount; Number of Terminations: 4; Package Quantity: 1; Packaging: Tape and Reel; Power Rating: 500mW; Pricing 1: 1=0.89, 10=0.784, 25=0.721, 50=0.657, 100=0.569, 250=0.48 (USD); Pricing 2: 1=0.89, 10=0.784, 25=0.7212, 50=0.6578, 100=0.5693, 250=0.48072, 500=0.4048, 1000=0.34408 (USD); REACH SVHC: Unknown; Stock 1: 41390; Stock 2: 186044; Supplier 1: Mouser; Supplier 2: Digi-Key; Supplier Part Number 1: 588-LVK12R010DER; Supplier Part Number 2: LVK12R010DERCT-ND; Termination: SMD/SMT; Weight: 0.000571oz; Width: 1.6mm
U6 = FDS6898AZ: MOSFET 2N-CH 20V 9.4A 8SOIC; Manufacturer: ON Semiconductor / Fairchild; Drain to Source Resistance: 14mR; Element Configuration: Dual; Fall Time: 16ns; FET Type: 2 N-Channel; Gate to Source Voltage (Vgs): 12V; Input Capacitance: 1.821nF; Max Power Dissipation: 2W; Nominal Vgs: 1V; Number of Elements: 2; Rise Time: 15ns; Turn-Off Delay Time: 34ns; Turn-On Delay Time: 10ns; Partnumber: FDS6898AZ; Case/Package: SOIC; ComponentLink1Description: http://www.farnell.com/datasheets/78816.pdf?src-supplier=Element14; ComponentLink1URL: http://www.farnell.com/datasheets/78816.pdf?src-supplier=Element14; ComponentLink2Description: http://www.jameco.com/Jameco/Products/ProdDS/2036226.pdf?src-supplier=Jameco; ComponentLink2URL: http://www.jameco.com/Jameco/Products/ProdDS/2036226.pdf?src-supplier=Jameco; ComponentLink3Description: https://www.fairchildsemi.com/datasheets/FD/FDS6898AZ.pdf?src-supplier=Avnet+Europe; ComponentLink3URL: https://www.fairchildsemi.com/datasheets/FD/FDS6898AZ.pdf?src-supplier=Avnet+Europe; ComponentLink4Description: http://www.fairchildsemi.com/ds/FD/FDS6898AZ.pdf?src-supplier=Future+Electronics; ComponentLink4URL: http://www.fairchildsemi.com/ds/FD/FDS6898AZ.pdf?src-supplier=Future+Electronics; ComponentLink5Description: https://www.fairchildsemi.com/datasheets/FD/FDS6898AZ.pdf?src-supplier=Avnet; ComponentLink5URL: https://www.fairchildsemi.com/datasheets/FD/FDS6898AZ.pdf?src-supplier=Avnet; ComponentLink6Description: http://www.fairchildsemi.com/datasheets/FD/FDS6898AZ.pdf?src-supplier=Digi-Key; ComponentLink6URL: http://www.fairchildsemi.com/datasheets/FD/FDS6898AZ.pdf?src-supplier=Digi-Key; ComponentLink7Description: https://www.fairchildsemi.com/datasheets/FD/FDS6898AZ.pdf?src-supplier=Digi-Key; ComponentLink7URL: https://www.fairchildsemi.com/datasheets/FD/FDS6898AZ.pdf?src-supplier=Digi-Key; ComponentLink8Description: http://www.mouser.com/ds/2/149/FDS6898AZ-52419.pdf?src-supplier=Mouser; ComponentLink8URL: http://www.mouser.com/ds/2/149/FDS6898AZ-52419.pdf?src-supplier=Mouser; ComponentLink9Description: http://www.farnell.com/datasheets/78816.pdf?src-supplier=Farnell; ComponentLink9URL: http://www.farnell.com/datasheets/78816.pdf?src-supplier=Farnell; ComponentLink10Description: http://datasheet.iiic.cc/fairchild/FDS6898AZ.pdf?src-supplier=IIIC; ComponentLink10URL: http://datasheet.iiic.cc/fairchild/FDS6898AZ.pdf?src-supplier=IIIC; Contact Plating: Tin,Matte; Continuous Drain Current (ID): 9.4A; Current Rating: 9.4A; Drain to Source Breakdown Voltage: 20V; Drain to Source Voltage (Vdss): 20V; Dual Supply Voltage: 20V; Height: 1.5mm; Lead Free: Lead Free; Length: 5mm; Manufacturer Part Number: FDS6898AZ; Max Operating Temperature: 150°C; Min Operating Temperature: -55°C; Mount: Surface Mount; Number of Pins: 8; On-State Resistance: 14MR; Package Quantity: 2500; Packaging: Tape and Reel; Power Dissipation: 2W; Pricing 1: 1=0.95, 10=0.809, 100=0.607, 250=0.588, 500=0.514, 1000=0.419 (USD); Pricing 2: 1=0.95, 10=0.853, 25=0.8096, 100=0.6071, 250=0.60132, 500=0.5146, 1000=0.4192 (USD); Rds On Max: 14mR; REACH SVHC: No SVHC; Stock 1: 4140; Stock 2: 0; Supplier 1: Mouser; Supplier 2: Digi-Key; Supplier Part Number 1: 512-FDS6898AZ; Supplier Part Number 2: FDS6898AZCT-ND; Termination: SMD/SMT; Threshold Voltage: 1V; Voltage Rating (DC): 20V; Weight: 0.187g; Width: 4mm
U7 = DS2777G+: Battery Management 2-Cell, Stand-Alone, Li+ Fuel-Gauge IC with Protector and Optional SHA-1 Authentication; Manufacturer: Maxim; Manufacturer Part Number: DS2775G+; Output Voltage: 4.7V; Operating Supply Current: 80uA; Min Supply Voltage: 4V; Max Supply Voltage: 9.2V; Interface: Serial; Partnumber: DS2777G+; Supplier 1: Mouser; Supplier Part Number 1: 700-DS2775G; Stock 1: 0; Mount: Surface Mount; Case/Package: DFN; Number of Pins: 14; Min Operating Temperature: -20°C; Max Operating Temperature: 70°C; Packaging: Rail/Tube; Package Quantity: 60; Radiation Hardening: No; REACH SVHC: Unknown; ComponentLink1URL: http://datasheets.maximintegrated.com/en/ds/DS2775-DS2778.pdf?src-supplier=Digi-Key; ComponentLink1Description: http://datasheets.maximintegrated.com/en/ds/DS2775-DS2778.pdf?src-supplier=Digi-Key; ComponentLink2URL: http://datasheets.maxim-ic.com/en/ds/DS2775-DS2778.pdf?src-supplier=Avnet+Europe; ComponentLink2Description: http://datasheets.maxim-ic.com/en/ds/DS2775-DS2778.pdf?src-supplier=Avnet+Europe; Supplier 2: Digi-Key; Supplier Part Number 2: DS2775G+-ND; Stock 2: 193; Pricing 2: 1=5.92, 10=5.35, 25=5.1008, 100=4.2299, 250=3.85672, 500=3.8256 (USD)
U26 = TLV341AIDBVR: Manufacturer: Texas Instruments; Bandwidth: 2.2MHz; Common Mode Rejection Ratio: 50dB; Gain Bandwidth Product: 2.3MHz; Input Bias Current: 3nA; Input Offset Voltage (Vos): 1.25mV; Max Supply Voltage: 5.5V; Min Supply Voltage: 1.5V; Nominal Supply Current: 150uA; Number of Channels: 1; Operating Supply Current: 75uA; Output Current: 115mA; Slew Rate: 0.9V/µs; Voltage Gain: 110dB; Partnumber: TLV341AIDBVR; Case/Package: SOT-23-6; ComponentLink1Description: http://www.ti.com/lit/ds/symlink/tlv341.pdf?src-supplier=Digi-Key; ComponentLink1URL: http://www.ti.com/lit/ds/symlink/tlv341.pdf?src-supplier=Digi-Key; ComponentLink2Description: http://focus.ti.com/lit/ds/symlink/tlv341.pdf?src-supplier=Avnet; ComponentLink2URL: http://focus.ti.com/lit/ds/symlink/tlv341.pdf?src-supplier=Avnet; Lead Free: Lead Free; Manufacturer Part Number: TLV341AIDBVR; Max I/O Voltage: 1.25mV; Max Operating Temperature: 125°C; Min Operating Temperature: -40°C; Nominal Gain Bandwidth Product: 2.2MHz; Number of Circuits: 1; Number of Elements: 1; Number of Pins: 6; Output Current per Channel: 115mA; Package Quantity: 1; Packaging: Tape and Reel; Pricing 1: 1=1.1, 10=0.927, 100=0.712, 250=0.629, 500=0.596, 1000=0.464 (USD); Pricing 2: 1=1.09, 10=0.976, 25=0.9268, 100=0.7117, 250=0.62892, 500=0.5958, 1000=0.4634 (USD); Radiation Hardening: No; Stock 1: 2448; Stock 2: 1726; Supplier 1: Mouser; Supplier 2: Digi-Key; Supplier Part Number 1: 595-TLV341AIDBVR; Supplier Part Number 2: 296-17680-1-ND; Unity Gain Bandwidth Product: 2.3MHz
VBUS_LED = LED/G_0603: SMD Green LED; Partnumber: 150060VS75000; Manufacturer: Wurth Electronics; Dominant Wavelength: 570nm; Forward Current: 30mA; Forward Voltage: 2V; Lens Style: Clear,Rectangular; Luminous Intensity: 40mcd; Test Current: 20mA; Viewing Angle: 140°; NCM: 8541.40.21; Case/Package: 0603; Case Code (Imperial): 0603; Case Code (Metric): 1608; Color: Green; ComponentLink1Description: https://katalog.we-online.de/led/datasheet/150060VS75000.pdf?src-supplier=Digi-Key; ComponentLink1URL: https://katalog.we-online.de/led/datasheet/150060VS75000.pdf?src-supplier=Digi-Key; Height: 0.7mm; Length: 1.6mm; Manufacturer Part Number: 150060VS75000; Max Operating Temperature: 85°C; Min Operating Temperature: -40°C; Mount: Surface Mount; Number of Pins: 2; Package Quantity: 1; Packaging: Tape and Reel; Pricing 1: 1=0.14, 10=0.138, 25=0.138, 50=0.129, 100=0.11, 250=0.11 (USD); Pricing 2: 1=0.14, 50=0.133, 100=0.114, 500=0.099 (USD); REACH SVHC: Unknown; Stock 1: 16336; Stock 2: 31910; Supplier 1: Mouser; Supplier 2: Digi-Key; Supplier Part Number 1: 710-150060VS75000; Supplier Part Number 2: 732-4980-1-ND; Wavelength: 570nm; Width: 0.8mm